# EAGLE design S181C (EAGLE 6.6.0)
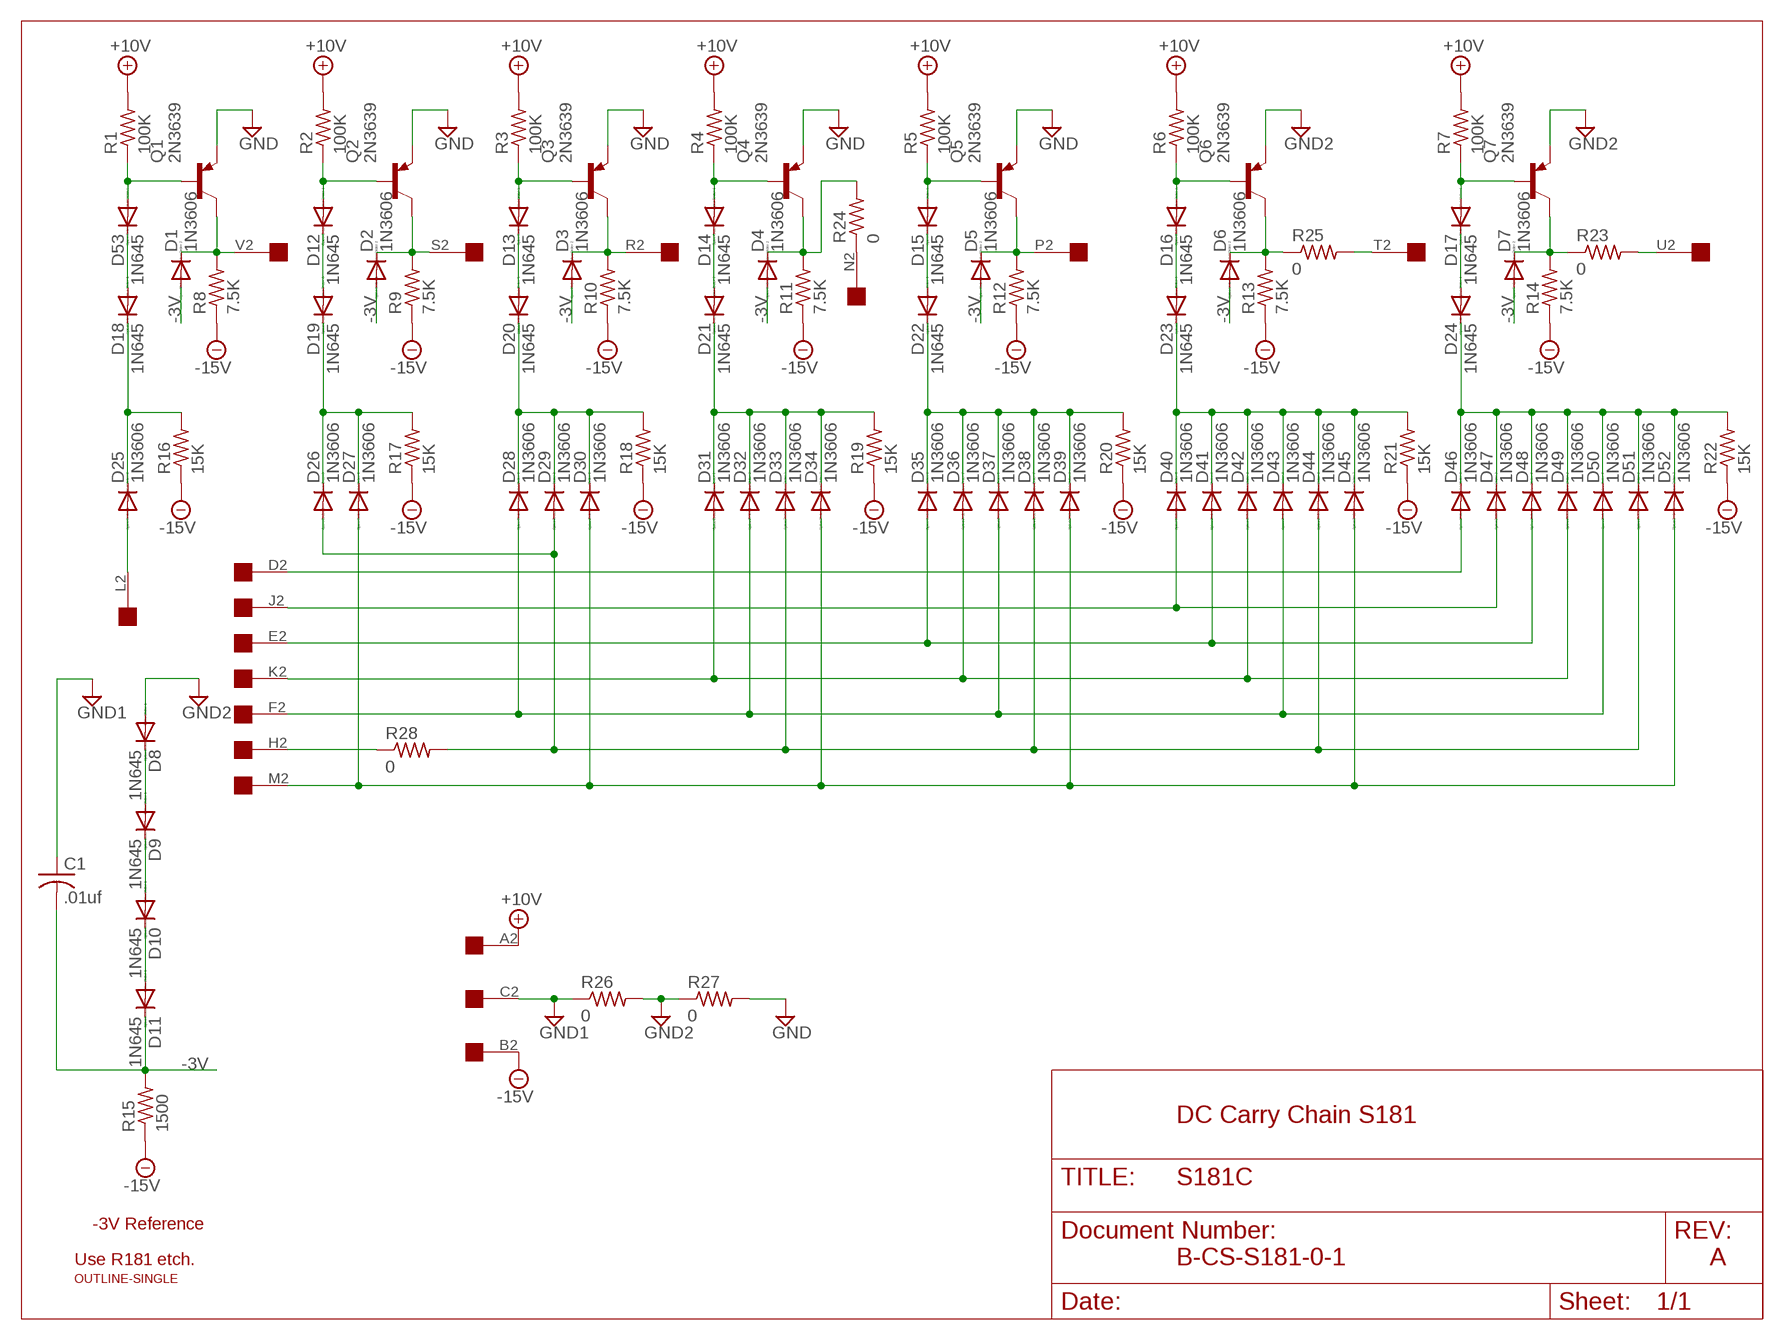
[diagram p0: schematic, sheet 1]

## Parts
C1  .01uf  C-US050-025X075  [C050-025X075]
D1  1N3606  1N4148DO35-10  [DO35-10]
D2  1N3606  1N4148DO35-10  [DO35-10]
D3  1N3606  1N4148DO35-10  [DO35-10]
D4  1N3606  1N4148DO35-10  [DO35-10]
D5  1N3606  1N4148DO35-10  [DO35-10]
D6  1N3606  1N4148DO35-10  [DO35-10]
D7  1N3606  1N4148DO35-10  [DO35-10]
D8  1N645  1N4148DO35-10  [DO35-10]
D9  1N645  1N4148DO35-10  [DO35-10]
D10  1N645  1N4148DO35-10  [DO35-10]
D11  1N645  1N4148DO35-10  [DO35-10]
D12  1N645  1N4148DO35-10  [DO35-10]
D13  1N645  1N4148DO35-10  [DO35-10]
D14  1N645  1N4148DO35-10  [DO35-10]
D15  1N645  1N4148DO35-10  [DO35-10]
D16  1N645  1N4148DO35-10  [DO35-10]
D17  1N645  1N4148DO35-10  [DO35-10]
D18  1N645  1N4148DO35-10  [DO35-10]
D19  1N645  1N4148DO35-10  [DO35-10]
D20  1N645  1N4148DO35-10  [DO35-10]
D21  1N645  1N4148DO35-10  [DO35-10]
D22  1N645  1N4148DO35-10  [DO35-10]
D23  1N645  1N4148DO35-10  [DO35-10]
D24  1N645  1N4148DO35-10  [DO35-10]
D25  1N3606  1N4148DO35-10  [DO35-10]
D26  1N3606  1N4148DO35-10  [DO35-10]
D27  1N3606  1N4148DO35-10  [DO35-10]
D28  1N3606  1N4148DO35-10  [DO35-10]
D29  1N3606  1N4148DO35-10  [DO35-10]
D30  1N3606  1N4148DO35-10  [DO35-10]
D31  1N3606  1N4148DO35-10  [DO35-10]
D32  1N3606  1N4148DO35-10  [DO35-10]
D33  1N3606  1N4148DO35-10  [DO35-10]
D34  1N3606  1N4148DO35-10  [DO35-10]
D35  1N3606  1N4148DO35-10  [DO35-10]
D36  1N3606  1N4148DO35-10  [DO35-10]
D37  1N3606  1N4148DO35-10  [DO35-10]
D38  1N3606  1N4148DO35-10  [DO35-10]
D39  1N3606  1N4148DO35-10  [DO35-10]
D40  1N3606  1N4148DO35-10  [DO35-10]
D41  1N3606  1N4148DO35-10  [DO35-10]
D42  1N3606  1N4148DO35-10  [DO35-10]
D43  1N3606  1N4148DO35-10  [DO35-10]
D44  1N3606  1N4148DO35-10  [DO35-10]
D45  1N3606  1N4148DO35-10  [DO35-10]
D46  1N3606  1N4148DO35-10  [DO35-10]
D47  1N3606  1N4148DO35-10  [DO35-10]
D48  1N3606  1N4148DO35-10  [DO35-10]
D49  1N3606  1N4148DO35-10  [DO35-10]
D50  1N3606  1N4148DO35-10  [DO35-10]
D51  1N3606  1N4148DO35-10  [DO35-10]
D52  1N3606  1N4148DO35-10  [DO35-10]
D53  1N645  1N4148DO35-10  [DO35-10]
Q1  2N3639  2N3637  [TO39]
Q2  2N3639  2N3637  [TO39]
Q3  2N3639  2N3637  [TO39]
Q4  2N3639  2N3637  [TO39]
Q5  2N3639  2N3637  [TO39]
Q6  2N3639  2N3637  [TO39]
Q7  2N3639  2N3637  [TO39]
R1  100K  R-US_0207/10  [0207/10]
R2  100K  R-US_0207/10  [0207/10]
R3  100K  R-US_0207/10  [0207/10]
R4  100K  R-US_0207/10  [0207/10]
R5  100K  R-US_0207/10  [0207/10]
R6  100K  R-US_0207/10  [0207/10]
R7  100K  R-US_0207/10  [0207/10]
R8  7.5K  R-US_0207/10  [0207/10]
R9  7.5K  R-US_0207/10  [0207/10]
R10  7.5K  R-US_0207/10  [0207/10]
R11  7.5K  R-US_0207/10  [0207/10]
R12  7.5K  R-US_0207/10  [0207/10]
R13  7.5K  R-US_0207/10  [0207/10]
R14  7.5K  R-US_0207/10  [0207/10]
R15  1500  R-US_0207/10  [0207/10]
R16  15K  R-US_0207/10  [0207/10]
R17  15K  R-US_0207/10  [0207/10]
R18  15K  R-US_0207/10  [0207/10]
R19  15K  R-US_0207/10  [0207/10]
R20  15K  R-US_0207/10  [0207/10]
R21  15K  R-US_0207/10  [0207/10]
R22  15K  R-US_0207/10  [0207/10]
R23  0  R-US_0207/10  [0207/10]
R24  0  R-US_0207/10  [0207/10]
R25  0  R-US_0207/10  [0207/10]
R26  0  R-US_0207/10  [0207/10]
R27  0  R-US_0207/10  [0207/10]
R28  0  R-US_0207/10  [0207/10]
U$1  OUTLINE-SINGLE  [SINGLE]
U$2  EDGE-1  [EDGE-CON1]

## Nets
+10V [Power]: R1.2 R2.2 R3.2 R4.2 R5.2 R6.2 R7.2 U$2.A2
-3V [Power]: C1.2 D1.A D2.A D3.A D4.A D5.A D6.A D7.A D11.C R15.2
-15V [Power]: R8.1 R9.1 R10.1 R11.1 R12.1 R13.1 R14.1 R15.1 R16.1 R17.1 R18.1 R19.1 R20.1 R21.1 R22.1 U$2.B2
GND [Power]: Q1.1(E) Q2.1(E) Q3.1(E) Q4.1(E) Q5.1(E) R27.2
GND1 [Power]: C1.1 R26.1 U$2.C2
GND2 [Power]: D8.A Q6.1(E) Q7.1(E) R26.2 R27.1
N: D4.C Q4.3(C) R11.2 R24.2
N$1: D26.A D29.A D33.A D38.A D44.A D51.A R28.2
N$2: D12.A Q2.2(B) R2.1
N$3: D8.C D9.A
N$4: R28.1 U$2.H2
N$5: D25.A U$2.L2
N$6: D19.C D26.C D27.C R17.2
N$7: D12.C D19.A
N$8: D13.A Q3.2(B) R3.1
N$9: D27.A D30.A D34.A D39.A D45.A D52.A U$2.M2
N$10: D35.A D41.A D48.A U$2.E2
N$11: D20.C D28.C D29.C D30.C R18.2
N$12: D13.C D20.A
N$13: D9.C D10.A
N$14: D28.A D32.A D37.A D43.A D50.A U$2.F2
N$15: D31.A D36.A D42.A D49.A U$2.K2
N$16: D10.C D11.A
N$17: R23.2 U$2.U2
N$18: D14.A Q4.2(B) R4.1
N$19: D53.A Q1.2(B) R1.1
N$20: D40.A D47.A U$2.J2
N$21: R25.2 U$2.T2
N$22: D18.C D25.C R16.2
N$23: D18.A D53.C
N$24: D46.A U$2.D2
N$25: R24.1 U$2.N2
N$26: D21.C D31.C D32.C D33.C D34.C R19.2
N$27: D14.C D21.A
N$33: D15.A Q5.2(B) R5.1
N$34: D22.C D35.C D36.C D37.C D38.C D39.C R20.2
N$35: D15.C D22.A
N$36: D16.A Q6.2(B) R6.1
N$37: D23.C D40.C D41.C D42.C D43.C D44.C D45.C R21.2
N$38: D16.C D23.A
N$40: D17.A Q7.2(B) R7.1
N$41: D24.C D46.C D47.C D48.C D49.C D50.C D51.C D52.C R22.2
N$42: D17.C D24.A
P: D5.C Q5.3(C) R12.2 U$2.P2
R: D3.C Q3.3(C) R10.2 U$2.R2
S: D2.C Q2.3(C) R9.2 U$2.S2
T: D6.C Q6.3(C) R13.2 R25.1
U: D7.C Q7.3(C) R14.2 R23.1
V: D1.C Q1.3(C) R8.2 U$2.V2

## Notes on the sheet
- DC Carry Chain S181
- -3V Reference
- Use R181 etch. | B-CS-S181-0-1 | A

## Library data of the parts
C1 = rcl:C-US: CAPACITOR, American symbol
D1-D53 = diode:1N4148: DIODE high speed (Philips)
Q1-Q7 = transistor-pnp:2N3637*: PNP Transistror
R1-R28 = rcl:R-US_: RESISTOR, American symbol
U$1 = dec-con:OUTLINE-*: Board outlines for DEC boards.
U$2 = dec-con:EDGE-1: Single-Sided DEC Edge Connector -- (side 2)

## Net classes
1 Power: width 0.813 mm

## Board
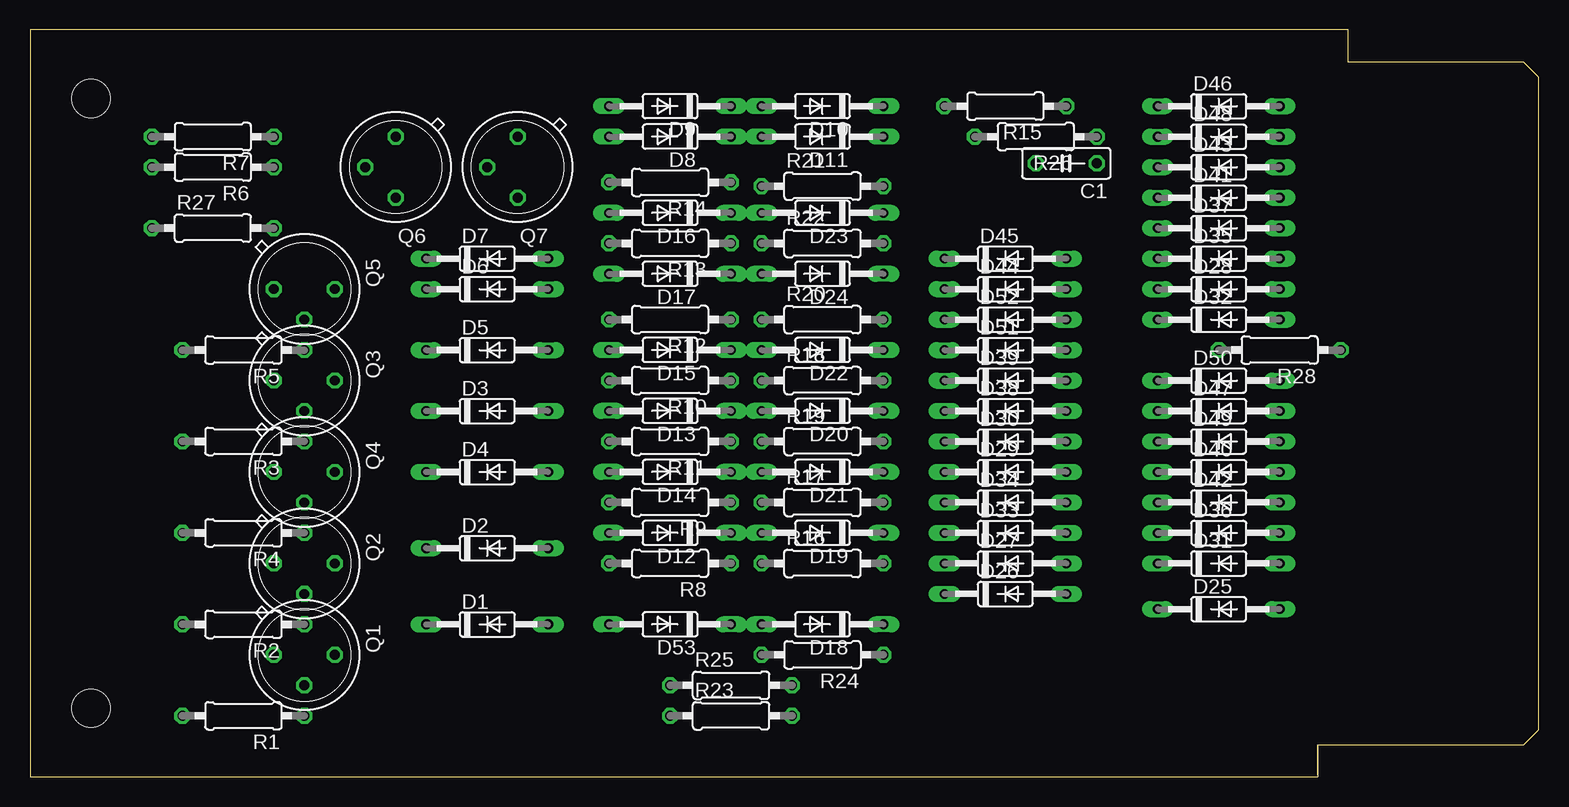
[diagram p1: board, top side]
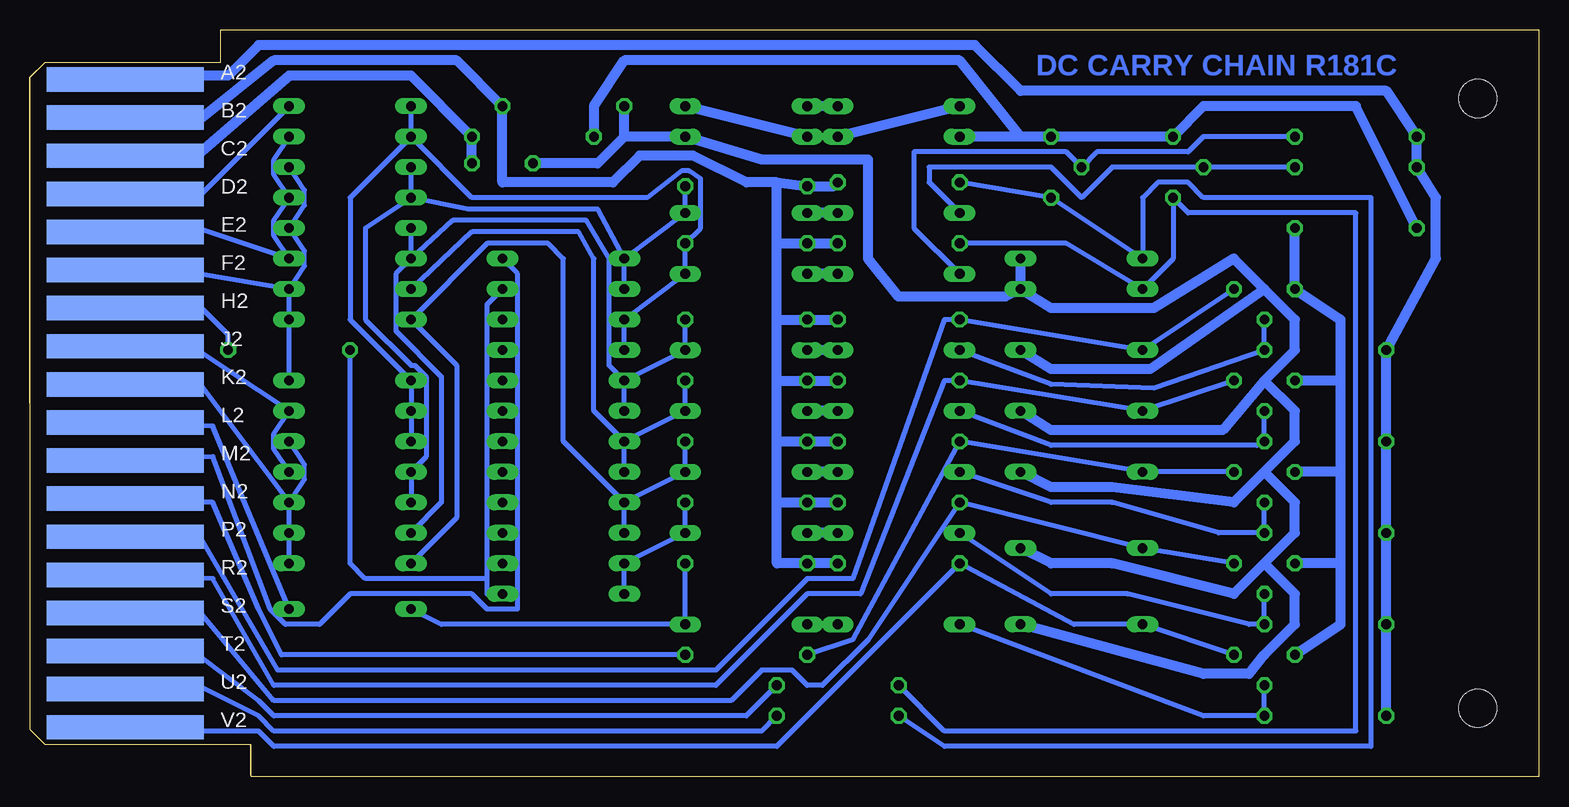
[diagram p2: board, bottom side, seen from below]

Size 125.73 x 62.23 mm. Coordinates in mm from the lower left corner, seen from the top.
Copper layers (1+16): Top 0.035mm / dielectric 1.5mm / Bottom 0.035mm
Design rules "16mils": minimum track width 16mil, minimum drill 32mil, track to track 15mil, track to pad 10mil, pad to pad 10mil, via to via 10mil, smd to smd 10mil, copper to edge 13mil, drill to drill 10mil, minimum pad ring 10mil, minimum via ring 8mil, stop-mask expansion 0mil, vias tented up to drill 0mil, thermal gap 10mil

### Footprints (pad centres in the part's own frame; a part is rotated, then mirrored left to right if it is on the bottom)
C050-025X075 = drill 0.813 octagon: 1 -2.54,0; 2 2.54,0
DO35-10 = drill 0.813 long: A 5.08,0; C -5.08,0
TO39 = drill 0.813 octagon: 1 0,-2.54; 2 2.54,0; 3 0,2.54
0207/10 = drill 0.813 octagon: 1 -5.08,0; 2 5.08,0
SINGLE = hole 3.175: 120.65,56.515; 120.65,5.715
EDGE-CON1 = smd 13.106 x 2.032 bottom: A2 7.938,4.128; B2 7.938,7.303; C2 7.938,10.477; D2 7.938,13.652; E2 7.938,16.828; F2 7.938,20.003; H2 7.938,23.177; J2 7.938,26.352; K2 7.938,29.527; L2 7.938,32.703; M2 7.938,35.877; N2 7.938,39.053; P2 7.938,42.227; R2 7.938,45.403; S2 7.938,48.578; T2 7.938,51.752; U2 7.938,54.928; V2 7.938,58.102

### Placement (x,y rotation side)
C1  86.36,51.12 180 top
D1  38.1,12.7 0 top
D2  38.1,19.05 0 top
D3  38.1,30.48 0 top
D4  38.1,25.4 0 top
D5  38.1,35.56 0 top
D6  38.1,40.64 0 top
D7  38.1,43.18 0 top
D8  53.34,53.34 180 top
D9  53.34,55.88 180 top
D10  66.04,55.88 180 top
D11  66.04,53.34 180 top
D12  53.34,20.32 180 top
D13  53.34,30.48 180 top
D14  53.34,25.4 180 top
D15  53.34,35.56 180 top
D16  53.34,46.99 180 top
D17  53.34,41.91 180 top
D18  66.04,12.7 180 top
D19  66.04,20.32 180 top
D20  66.04,30.48 180 top
D21  66.04,25.4 180 top
D22  66.04,35.56 180 top
D23  66.04,46.99 180 top
D24  66.04,41.91 180 top
D25  99.06,13.97 0 top
D26  81.28,15.24 0 top
D27  81.28,17.78 0 top
D28  99.06,40.64 0 top
D29  81.28,25.4 0 top
D30  81.28,27.94 0 top
D31  99.06,17.78 0 top
D32  99.06,38.1 0 top
D33  81.28,20.32 0 top
D34  81.28,22.86 0 top
D35  99.06,43.18 0 top
D36  99.06,20.32 0 top
D37  99.06,45.72 0 top
D38  81.28,30.48 0 top
D39  81.28,33.02 0 top
D40  99.06,25.4 0 top
D41  99.06,48.26 0 top
D42  99.06,22.86 0 top
D43  99.06,50.8 0 top
D44  81.28,40.64 0 top
D45  81.28,43.18 0 top
D46  99.06,55.88 0 top
D47  99.06,30.48 0 top
D48  99.06,53.34 0 top
D49  99.06,27.94 0 top
D50  99.06,33.02 0 top
D51  81.28,35.56 0 top
D52  81.28,38.1 0 top
D53  53.34,12.7 180 top
Q1  22.86,10.16 270 top
Q2  22.86,17.78 270 top
Q3  22.86,33.02 270 top
Q4  22.86,25.4 270 top
Q5  22.86,40.64 270 top
Q6  30.48,50.8 180 top
Q7  40.64,50.8 180 top
R1  17.78,5.08 180 top
R2  17.78,12.7 180 top
R3  17.78,27.94 180 top
R4  17.78,20.32 180 top
R5  17.78,35.56 180 top
R6  15.24,50.8 180 top
R7  15.24,53.34 180 top
R8  53.34,17.78 180 top
R9  53.34,22.86 180 top
R10  53.34,33.02 180 top
R11  53.34,27.94 180 top
R12  53.34,38.1 180 top
R13  53.34,44.45 180 top
R14  53.34,49.53 180 top
R15  81.28,55.88 180 top
R16  66.04,17.78 0 top
R17  66.04,22.86 0 top
R18  66.04,33.02 0 top
R19  66.04,27.94 0 top
R20  66.04,38.1 0 top
R21  66.04,49.21 0 top
R22  66.04,44.45 0 top
R23  58.42,5.08 0 top
R24  66.04,10.16 180 top
R25  58.42,7.62 0 top
R26  83.82,53.34 180 top
R27  15.24,45.72 0 top
R28  104.14,35.56 180 top
U$1  125.73,62.23 180 top
U$2  125.73,62.23 180 top

### Tracks (layer width: path | path; a pad name or v marks a point on that pad's centre or on a via)
+10V
  Bottom 0.813: R1.2 R2.2 R4.2 R3.2 R5.2 8.57,43.18 8.57,48.26 R6.2 R7.2 12.7,57.15 43.18,57.15 46.99,60.96 106.68,60.96 109.22,58.42 118.11,58.42 U$2.A2
-3V
  Bottom 0.813: D1.A 27.94,8.57 24.13,8.57 22.86,10.16 20.32,12.7 20.32,15.24 22.86,17.78 | 22.86,17.78 20.32,20.32 20.32,22.86 22.86,25.4 | 22.86,25.4 20.32,27.94 20.32,30.48 22.86,33.02 | 22.86,33.02 20.32,35.56 20.32,38.1 22.86,40.64 | 22.86,40.64 25.4,43.18 32.07,39.05 40.64,39.05 D6.A | 22.86,17.78 25.4,15.24 35.56,17.78 40.64,17.78 D2.A | D4.A 40.64,24.13 35.56,24.13 25.4,22.86 22.86,25.4 | D3.A 40.64,28.89 26.35,28.89 22.86,33.02 | D5.A 40.64,33.97 32.38,33.97 22.86,40.64 | C1.2 78.42,51.12 76.2,53.34 | 76.2,53.34 R15.2 | 76.2,53.34 D11.C 64.77,51.44 55.88,51.44 55.88,43.18 53.34,40.01 44.45,40.01 D6.A | D6.A D7.A
-15V
  Bottom 0.813: 63.5,22.86 63.5,17.78 R16.1 R8.1 | 63.5,22.86 63.5,27.94 | 63.5,27.94 63.5,33.02 | 63.5,33.02 63.5,38.1 | 63.5,38.1 63.5,44.45 | 63.5,44.45 63.5,49.53 | R9.1 R17.1 63.5,22.86 | R11.1 R19.1 63.5,27.94 | R10.1 R18.1 63.5,33.02 | R12.1 R20.1 63.5,38.1 | 63.5,49.53 66.04,49.53 70.48,51.75 74.93,51.75 77.15,49.53 86.36,49.53 R15.1 90.17,59.69 105.41,59.69 111.76,54.61 U$2.B2 | R14.1 58.74,49.21 R21.1 63.5,49.53 | R13.1 R22.1 63.5,44.45
GND
  Bottom 0.813: Q1.1 16.51,12.7 16.51,17.78 | 16.51,17.78 16.51,25.4 | 16.51,25.4 16.51,33.02 | 16.51,33.02 16.51,38.1 Q5.1 R27.2 | 16.51,33.02 Q3.1 | 16.51,25.4 Q4.1 | 16.51,17.78 Q2.1
GND1
  Bottom 0.813: U$2.C2 111.44,52.07 104.14,58.42 93.98,58.42 R26.1 C1.1
GND2
  Bottom 0.813: 43.18,53.34 D8.A | 43.18,53.34 48.26,59.69 76.2,59.69 78.74,55.88 R26.2 | 43.18,53.34 Q7.1 Q6.1 27.94,55.88 15.24,55.88 R27.1
N
  Bottom 0.406: R24.2 57.15,11.43 R11.2 D4.C Q4.3
N$1
  Bottom 0.406: R28.2 99.06,17.78 97.79,16.51 87.63,16.51 | 87.63,16.51 87.63,15.24 D26.A | 87.63,16.51 87.63,20.32 | 87.63,20.32 87.63,25.4 | 87.63,25.4 87.63,30.48 | 87.63,30.48 87.63,35.56 | 87.63,35.56 87.63,39.37 D44.A | 87.63,35.56 D51.A | 87.63,30.48 D38.A | 87.63,25.4 D29.A | 87.63,20.32 D33.A
N$2
  Bottom 0.406: Q2.2 R2.1 24.13,12.7 34.29,15.24 40.64,15.24 D12.A
N$3
  Bottom 0.813: D9.A D8.C
N$4
  Bottom 0.406: U$2.H2 111.76,39.37 109.22,36.83 R28.1
N$5
  Bottom 0.406: U$2.L2 110.49,29.21 D25.A
N$6
  Bottom 0.406: R17.2 D19.C D27.C D26.C
N$7
  Bottom 0.813: D12.C D19.A
N$8
  Bottom 0.406: Q3.2 R3.1 23.5,27.62 40.64,27.62 D13.A
N$9
  Bottom 0.406: U$2.M2 110.49,26.67 105.73,13.97 104.46,12.7 101.6,12.7 99.06,15.24 88.9,15.24 87.63,13.97 85.09,13.97 85.09,17.78 | 85.09,17.78 85.09,22.86 | 85.09,22.86 85.09,27.94 | 85.09,27.94 85.09,33.02 | 85.09,33.02 85.09,38.1 | 85.09,38.1 85.09,41.91 D45.A | 85.09,38.1 D52.A | 85.09,33.02 D39.A | 85.09,27.94 D30.A | 85.09,17.78 D27.A | 85.09,22.86 D34.A
N$10
  Bottom 0.406: U$2.E2 111.76,45.72 D35.A 105.41,45.09 105.41,46.35 D41.A 105.41,50.16 105.41,51.44 D48.A
N$11
  Bottom 0.406: R18.2 D20.C D30.C | D29.C D30.C | D30.C 78.74,30.48 78.74,43.18 80.01,45.4 88.9,45.4 D28.C
N$12
  Bottom 0.813: D13.C D20.A
N$13
  Bottom 0.813: D9.C D10.A
N$14
  Bottom 0.406: U$2.F2 111.76,41.91 D28.A | D43.A 102.87,48.9 102.87,47.62 D37.A 102.87,43.81 102.87,42.55 D28.A | D28.A D32.A D50.A
N$15
  Bottom 0.406: U$2.K2 111.76,33.02 D42.A | D31.A D36.A D42.A | D42.A 102.87,24.77 102.87,26.04 D49.A
N$16
  Bottom 0.813: D11.A D10.C
N$17
  Bottom 0.406: U$2.U2 116.84,7.62 111.76,7.62 106.68,5.08 105.41,3.81 64.77,3.81 R23.2
N$18
  Bottom 0.406: Q4.2 R4.1 26.67,20.32 35.56,22.86 40.64,22.86 D14.A
N$19
  Bottom 0.406: R1.1 Q1.2 R1.1 | R1.1 27.94,5.08 D53.A
N$20
  Bottom 0.406: U$2.J2 111.76,35.56 D47.A 105.41,28.57 105.41,27.3 D40.A
N$21
  Bottom 0.406: U$2.T2 111.76,10.16 106.68,6.35 105.41,5.08 66.04,5.08 R25.2
N$22
  Bottom 0.406: R16.2 D18.C 91.44,12.7 D25.C
N$23
  Bottom 0.406: D53.C D18.A
N$24
  Bottom 0.406: U$2.D2 111.76,48.26 D46.A
N$25
  Bottom 0.406: U$2.N2 111.76,22.86 110.49,22.86 106.68,13.97 104.78,10.16 R24.1
N$26
  Bottom 0.406: R19.2 D21.C D34.C | D34.C D33.C D34.C | D34.C 81.28,27.94 81.28,43.18 82.55,44.45 87.63,44.45 D32.C 90.17,34.29 90.17,21.59 D31.C
N$27
  Bottom 0.813: D14.C D21.A
N$33
  Bottom 0.406: Q5.2 R5.1 32.07,32.38 40.64,32.7 D15.A
N$34
  Bottom 0.406: R20.2 D22.C D39.C | D38.C D39.C | D39.C 77.47,34.29 77.47,43.18 79.38,46.35 90.49,46.35 D35.C | D35.C D37.C | D36.C 91.44,22.86 91.44,33.34 95.25,37.15 95.25,41.91 D35.C
N$35
  Bottom 0.813: D15.C D22.A
N$36
  Bottom 0.406: R6.1 Q6.2 35.56,50.8 38.1,48.26 40.64,50.8 50.8,50.8 50.8,49.53 D16.A
N$37
  Bottom 0.406: R21.2 D23.C D45.C | D44.C D45.C | D45.C 78.42,47.31 89.22,47.31 D41.C | D41.C D43.C | D42.C D40.C 92.71,26.67 92.71,33.34 93.66,34.29 93.98,34.29 97.79,38.1 97.79,45.72 D41.C
N$38
  Bottom 0.813: D16.C D23.A
N$40
  Bottom 0.406: R7.1 27.94,53.34 29.21,52.07 36.83,52.07 Q7.2 39.37,52.07 52.07,52.07 52.07,45.72 D17.A
N$41
  Bottom 0.406: D48.C D46.C | D48.C 88.9,48.26 74.3,48.26 71.44,50.48 70.8,50.48 69.85,49.85 69.85,45.72 R22.2 D24.C D52.C D51.C | D48.C 99.06,48.26 99.06,38.1 D50.C D47.C D49.C
N$42
  Bottom 0.813: D17.C D24.A
P
  Bottom 0.406: U$2.P2 111.76,20.32 105.09,8.89 68.58,8.89 60.96,16.51 57.15,16.51 49.53,38.1 R12.2 D5.C Q5.3
R
  Bottom 0.406: U$2.R2 110.49,16.51 105.41,7.62 68.58,7.62 60.96,15.24 56.52,15.24 49.53,33.02 R10.2 D3.C Q3.3
S
  Bottom 0.406: U$2.S2 116.84,13.97 111.76,13.97 105.41,6.35 67.31,6.35 64.77,8.89 62.23,8.89 60.96,7.62 59.69,7.62 55.88,11.43 R9.2 D2.C Q2.3
T
  Bottom 0.406: R25.1 49.53,3.81 15.24,3.81 15.24,46.99 29.21,46.99 Q6.3 30.48,43.18 D6.C 39.37,44.45 R13.2
U
  Bottom 0.406: R23.1 49.53,2.54 13.97,2.54 13.97,48.26 27.94,48.26 29.21,49.53 31.75,49.53 33.02,48.26 D7.C Q7.3 R14.2
V
  Bottom 0.406: U$2.V2 118.11,4.13 118.11,3.81 106.68,3.81 105.41,2.54 63.5,2.54 R8.2 38.73,12.7 D1.C Q1.3

### Text on the board
Bottom: DC CARRY CHAIN R181C